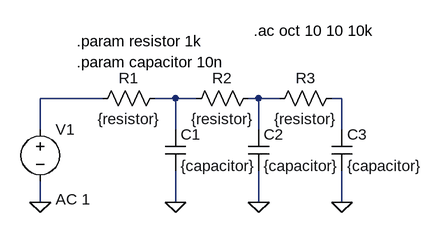
[diagram p0: schematic Draft8 param and step directives.asc]
Draft8 param and step directives.asc, the LTspice schematic file:
Version 4.1
SHEET 1 880 680
WIRE 64 48 -32 48
WIRE 176 48 144 48
WIRE 208 48 176 48
WIRE 304 48 288 48
WIRE 336 48 304 48
WIRE 432 48 416 48
WIRE -32 96 -32 48
WIRE 176 96 176 48
WIRE 304 96 304 48
WIRE 432 96 432 48
WIRE -32 208 -32 176
WIRE 176 208 176 160
WIRE 304 208 304 160
WIRE 432 208 432 160
FLAG -32 208 0
FLAG 176 208 0
FLAG 304 208 0
FLAG 432 208 0
SYMBOL voltage -32 80 R0
WINDOW 123 24 124 Left 2
WINDOW 39 0 0 Left 0
SYMATTR InstName V1
SYMATTR Value ""
SYMATTR Value2 AC 1
SYMBOL res 160 32 R90
WINDOW 0 0 56 VBottom 2
WINDOW 3 32 56 VTop 2
SYMATTR InstName R1
SYMATTR Value {resistor}
SYMBOL cap 160 96 R0
SYMATTR InstName C1
SYMATTR Value {capacitor}
SYMBOL res 304 32 R90
WINDOW 0 0 56 VBottom 2
WINDOW 3 32 56 VTop 2
SYMATTR InstName R2
SYMATTR Value {resistor}
SYMBOL cap 288 96 R0
SYMATTR InstName C2
SYMATTR Value {capacitor}
SYMBOL res 432 32 R90
WINDOW 0 0 56 VBottom 2
WINDOW 3 32 56 VTop 2
SYMATTR InstName R3
SYMATTR Value {resistor}
SYMBOL cap 416 96 R0
SYMATTR InstName C3
SYMATTR Value {capacitor}
TEXT 24 -40 Left 2 !.param resistor 1k
TEXT 24 -8 Left 2 !.param capacitor 10n
TEXT 296 -56 Left 2 !.ac oct 10 10 10k

The netlist it stands for:
* Draft8 param and step directives.asc
V1 N001 0 AC 1
R1 N002 N001 {resistor}
C1 N002 0 {capacitor}
R2 N003 N002 {resistor}
C2 N003 0 {capacitor}
R3 N004 N003 {resistor}
C3 N004 0 {capacitor}
.param resistor 1k
.param capacitor 10n
.ac oct 10 10 10k
.backanno
.end